# EAGLE design OpenponicsBoard_Photon_V1.0 (EAGLE 7.2.0)
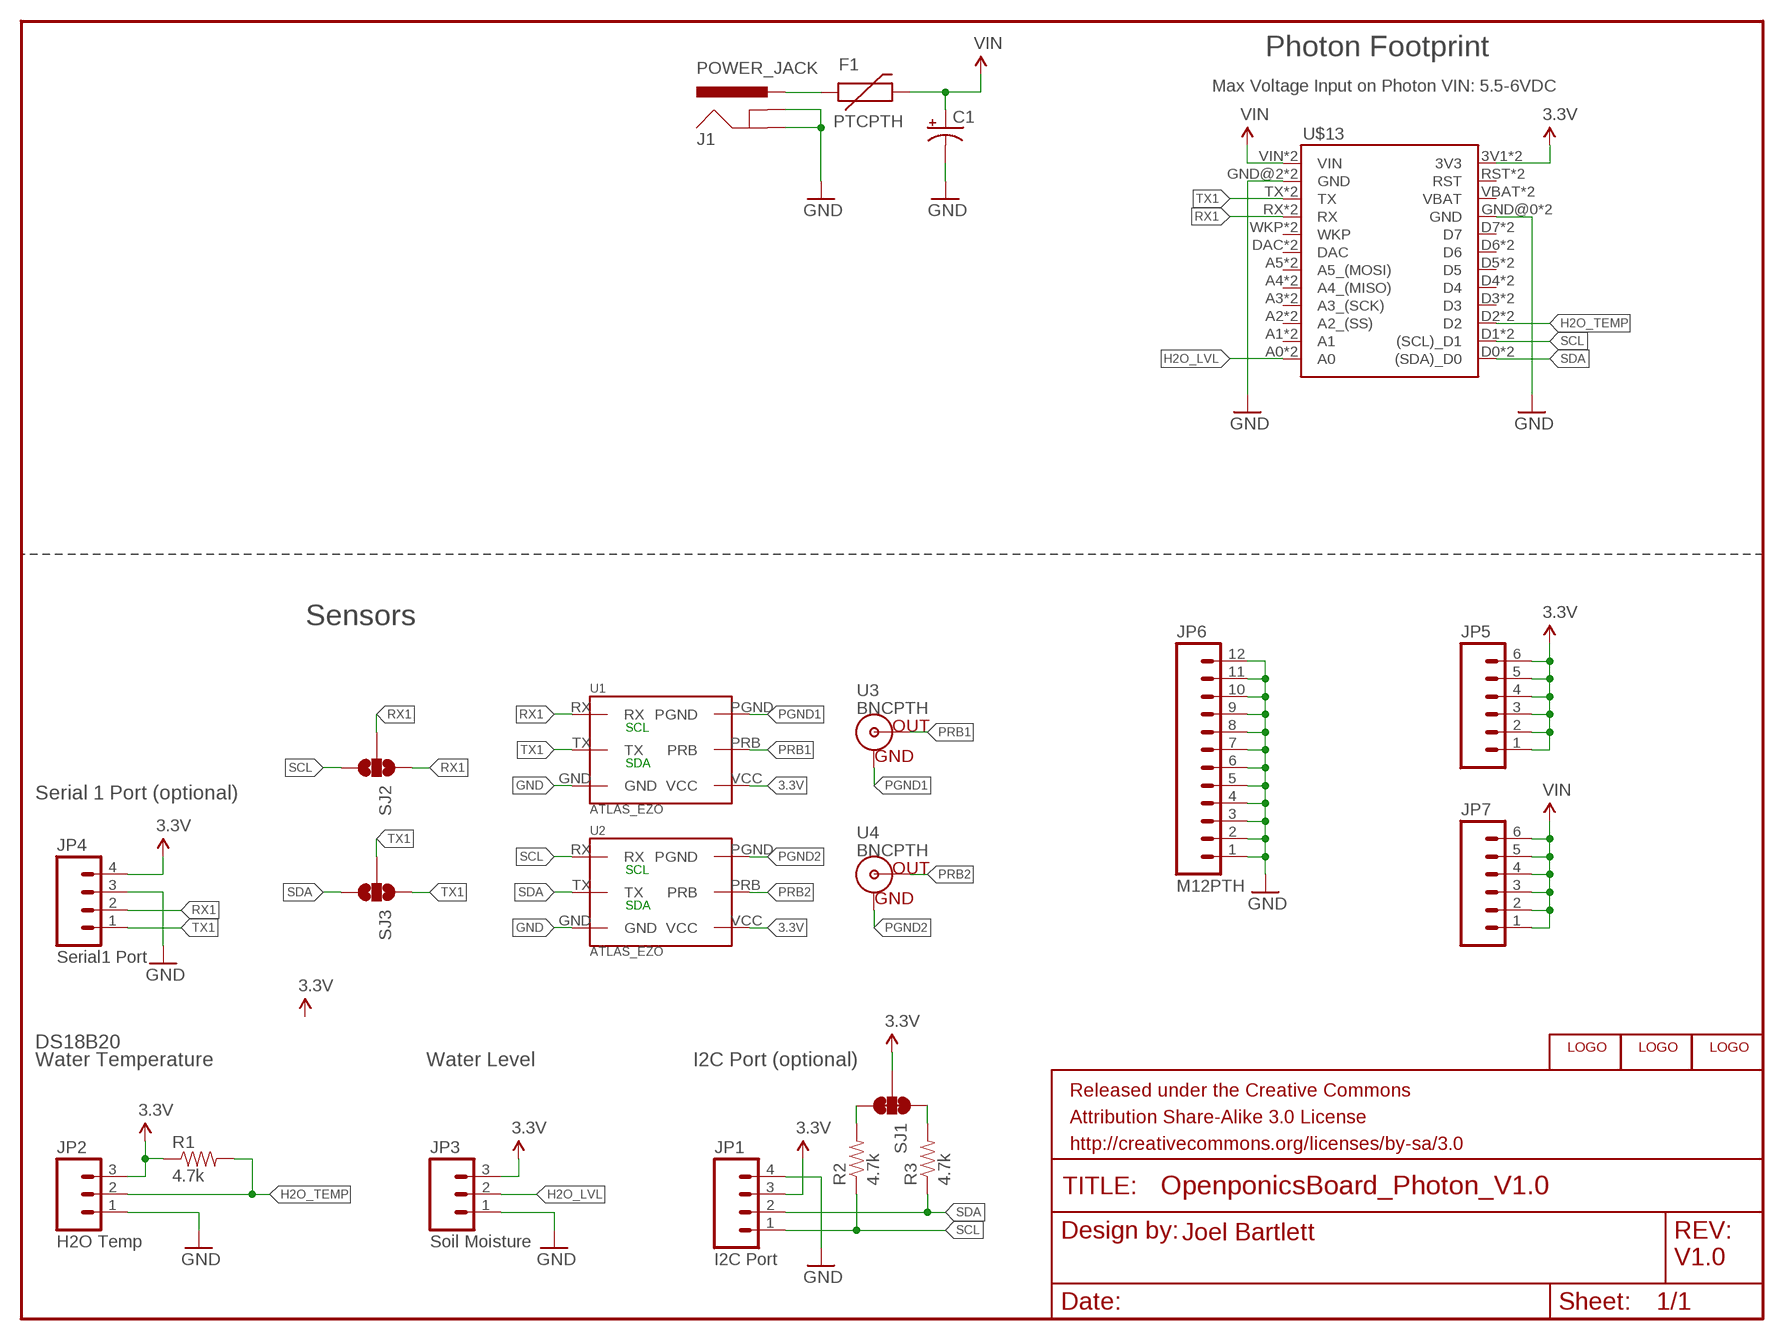
[diagram p0: schematic, sheet 1]

## Parts
C1  CAP_POLPTH1  [CPOL-RADIAL-100UF-25V]
F1  PTCPTH  [PTC]
FRAME1  FRAME-LETTER  [CREATIVE_COMMONS]
J1  POWER_JACK  POWER_JACKPTH  [POWER_JACK_PTH]
JP1  I2C Port  M04PTH  [1X04]
JP2  H2O Temp  M03PTH  [1X03]
JP3  Soil Moisture  M03PTH  [1X03]
JP4  Serial1 Port  M04PTH  [1X04]
JP5  M06SIP  [1X06]
JP6  M12PTH  [1X12]
JP7  M06SIP  [1X06]
R1  4.7k  RESISTORPTH-1/4W  [AXIAL-0.4]
R2  4.7k  RESISTORPTH-1/4W  [AXIAL-0.4]
R3  4.7k  RESISTORPTH-1/4W  [AXIAL-0.4]
SJ1  JUMPER-PAD-3-NC_BY_TRACE  [PAD-JUMPER-3-3OF3_NC_BY_TRACE_YES_SILK_FULL_BOX]
SJ2  SOLDERJUMPER_2WAYS  [SJ_3]
SJ3  SOLDERJUMPER_2WAYS  [SJ_3]
U1  ATLAS_EZO  [ATLAS_EZO]
U2  ATLAS_EZO  [ATLAS_EZO]
U3  BNCPTH  [BNC]
U4  BNCPTH  [BNC]
U$5  OPENPONICS_LOGO_SYMBOL  [OPENPONICS_LOGO_SYMBOL]
U$6  OPENPONICS_LOGO_SMALL  [OPENPONICS_LOGO_SMALL]
U$9  OPENPONICS_LOGO_SYMBOL_MED  [OPENPONICS_LOGO_SYMBOL_MED]
U$13  PHOTON_FOOTPRINT_X2  [PHOTON_FOOTPRINT_X2]

## Nets
3.3V: JP1.3 JP2.3 JP3.3 JP4.4 JP5.1 JP5.2 JP5.3 JP5.4 JP5.5 JP5.6 R1.P$1 SJ1.2 U1.VCC U2.VCC U$13.3V1(3V3) U$13.3V3
GND: C1.2(-) J1.GND J1.GNDBREAK JP1.4 JP2.1 JP3.1 JP4.3 JP6.1 JP6.2 JP6.3 JP6.4 JP6.5 JP6.6 JP6.7 JP6.8 JP6.9 JP6.10 JP6.11 JP6.12 U1.GND U2.GND U$13.GND@0(GND) U$13.GND@1(GND) U$13.GND@2(GND) U$13.GND@2_1(GND)
H2O_LVL: JP3.2 U$13.A0 U$13.A0_1(A0)
H2O_TEMP: JP2.2 R1.P$2 U$13.D2 U$13.D2_1(D2)
N$3: R2.P$2 SJ1.3
N$6: R3.P$2 SJ1.1
PGND1: U1.PGND U3.GND
PGND2: U2.PGND U4.GND
PRB1: U1.PRB U3.S(OUT)
PRB2: U2.PRB U4.S(OUT)
RAW: F1.P$1 J1.PWR
RX1: JP4.2 SJ2.1 SJ2.2 U1.RX U$13.RX U$13.RX1(RX)
SCL: JP1.1 R2.P$1 SJ2.3 U2.RX U$13.D1((SCL)_D1) U$13.D1_1((SCL)_D1)
SDA: JP1.2 R3.P$1 SJ3.3 U2.TX U$13.D0((SDA)_D0) U$13.D0_1((SDA)_D0)
TX1: JP4.1 SJ3.1 SJ3.2 U1.TX U$13.TX U$13.TX1(TX)
VIN: C1.1(+) F1.P$2 JP7.1 JP7.2 JP7.3 JP7.4 JP7.5 JP7.6 U$13.VIN U$13.VIN1(VIN)
Unconnected: U$13.A1 U$13.A1_1(A1) U$13.A2(A2_(SS)) U$13.A2_1(A2_(SS)) U$13.A3(A3_(SCK)) U$13.A3_1(A3_(SCK)) U$13.A4(A4_(MISO)) U$13.A4_1(A4_(MISO)) U$13.A5(A5_(MOSI)) U$13.A5_1(A5_(MOSI)) U$13.D3 U$13.D3_1(D3) U$13.D4 U$13.D4_1(D4) U$13.D5 U$13.D5_1(D5) U$13.D6 U$13.D6_1(D6) U$13.D7 U$13.D7_1(D7) U$13.DAC U$13.DAC1(DAC) U$13.RST U$13.RST1(RST) U$13.VBAT U$13.VBAT1(VBAT) U$13.WKP U$13.WKP1(WKP)

## Notes on the sheet
- Photon Footprint
- Max Voltage Input on Photon VIN: 5.5-6VDC
- Sensors
- SCL
- SDA
- Serial 1 Port (optional)
- SCL
- SDA
- DS18B20
- Water Temperature | Water Level | I2C Port (optional)
- Joel Bartlett
- V1.0

## Library data of the parts
C1 = SparkFun-Capacitors:CAP_POL: Capacitor Polarized These are standard SMD and PTH capacitors. Normally 10uF, 47uF, and 100uF in electrolytic and tantalum varieties. Always verify the external diameter of the through hole cap, it varies with capacity, voltage, and manufacturer. The EIA devices should be standard.
F1 = SparkFun-PowerIC:PTC: Resettable Fuse PTC Resettable Fuse. Spark Fun Electronics SKU : COM-08357
FRAME1 = SparkFun-Aesthetics:FRAME-LETTER: Schematic Frame Standard 8.5x11 US Letter frame
J1 = SparkFun-Connectors:POWER_JACK: Power Jack This is the standard 5.5mm barrel jack for power. The PTH is the most common, proven, reliable, footprint. The Slot footprint only works if the mill layer is transmitted to the PCB fab house so be warned. Spark Fun Electronics SKU : PRT-00119 SMT: CONN-08106 Mating wall wart : TOL-00298 (and others)
JP1 JP4 = SparkFun-Connectors:M04: Header 4 Standard 4-pin 0.1" header. Use with straight break away headers (SKU : PRT-00116), right angle break away headers (PRT-00553), swiss pins (PRT-00743), machine pins (PRT-00117), and female headers (PRT-00115). Molex polarized connector foot print use with SKU : PRT-08231 with associated crimp pins and housings. 1MM SMD Version SKU: PRT-10208
JP2 JP3 = SparkFun-Connectors:M03: Header 3 Standard 3-pin 0.1" header. Use with straight break away headers (SKU : PRT-00116), right angle break away headers (PRT-00553), swiss pins (PRT-00743), machine pins (PRT-00117), and female headers (PRT-00115). Molex polarized connector foot print use with SKU : PRT-08232 with associated crimp pins and housings.
JP5 JP7 = SparkFun-Connectors:M06: Header 6 Standard 6-pin 0.1" header. Use with straight break away headers (SKU : PRT-00116), right angle break away headers (PRT-00553), swiss pins (PRT-00743), machine pins (PRT-00117), and female headers (PRT-00115). Molex polarized connector foot print use with SKU : PRT-08094 with associated crimp pins and housings. NOTES ON THE VARIANTS LOCK and LOCK_LONGPADS... This footprint was designed to help hold the alignment of a through-hole component (i.e. 6-pin header) while soldering it into place. You may notice that each hole has been shifted either up or down by 0.005 of an inch from it's more standard position (which is a perfectly straight line). This slight alteration caused the pins (the squares in the middle) to touch the edges of the holes. Because they are alternating, it causes a "brace" to hold the component in place. 0.005 has proven to be the perfect amount of "off-center" position when using our standard breakaway headers. Although looks a little odd when you look at the bare footprint, once you have a header in there, the alteration is very hard to notice. Also,if you push a header all the way into place, it is covered up entirely on the bottom side. This idea of altering the position of holes to aid alignment will be further integrated into the Sparkfun Library for other footprints. It can help hold any component with 3 or more connection pins.
JP6 = SparkFun-Connectors:M12: Header 12 Standard 12-pin 0.1" header. Use with straight break away headers (SKU : PRT-00116), right angle break away headers (PRT-00553), swiss pins (PRT-00743), machine pins (PRT-00117), and female headers (PRT-00115).
R1-R3 = SparkFun-Resistors:RESISTOR: Resistor Basic schematic elements and footprints for 0603, 1206, and PTH resistors.
SJ1 = SparkFun-Passives:JUMPER-PAD-3-NC_BY_TRACE
SJ2 SJ3 = SparkFun-Passives:SOLDERJUMPER_2WAY: Solder Jumper 2 way solder jumper
U1 U2 = AtlasScientific:ATLAS_EZO: Atlas Scientific EZO Circuit
U3 U4 = SparkFun-Connectors:BNC: BNC Connector, Mouser Part# 5227161
U$5 = Openponics:OPENPONICS_LOGO_SYMBOL
U$6 = Openponics:OPENPONICS_LOGO_SMALL
U$9 = Openponics:OPENPONICS_LOGO_SYMBOL_MED
U$13 = Openponics:PHOTON_FOOTPRINT_X2

## Net classes
0 Default: width 0.203 mm
1 vcc: width 0.203 mm

## Board
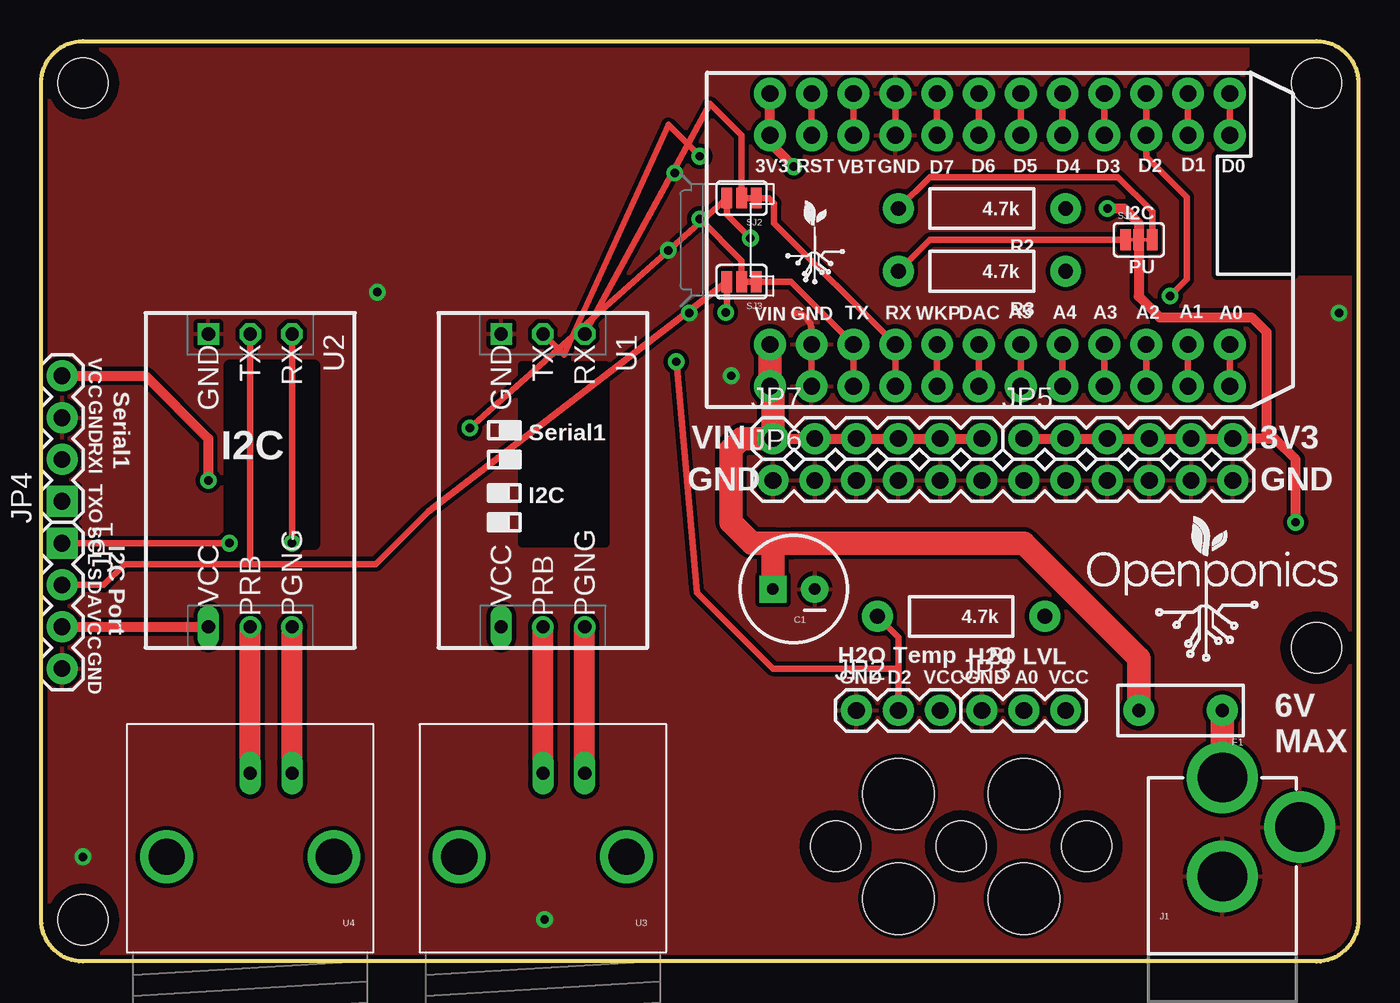
[diagram p1: board, top side]
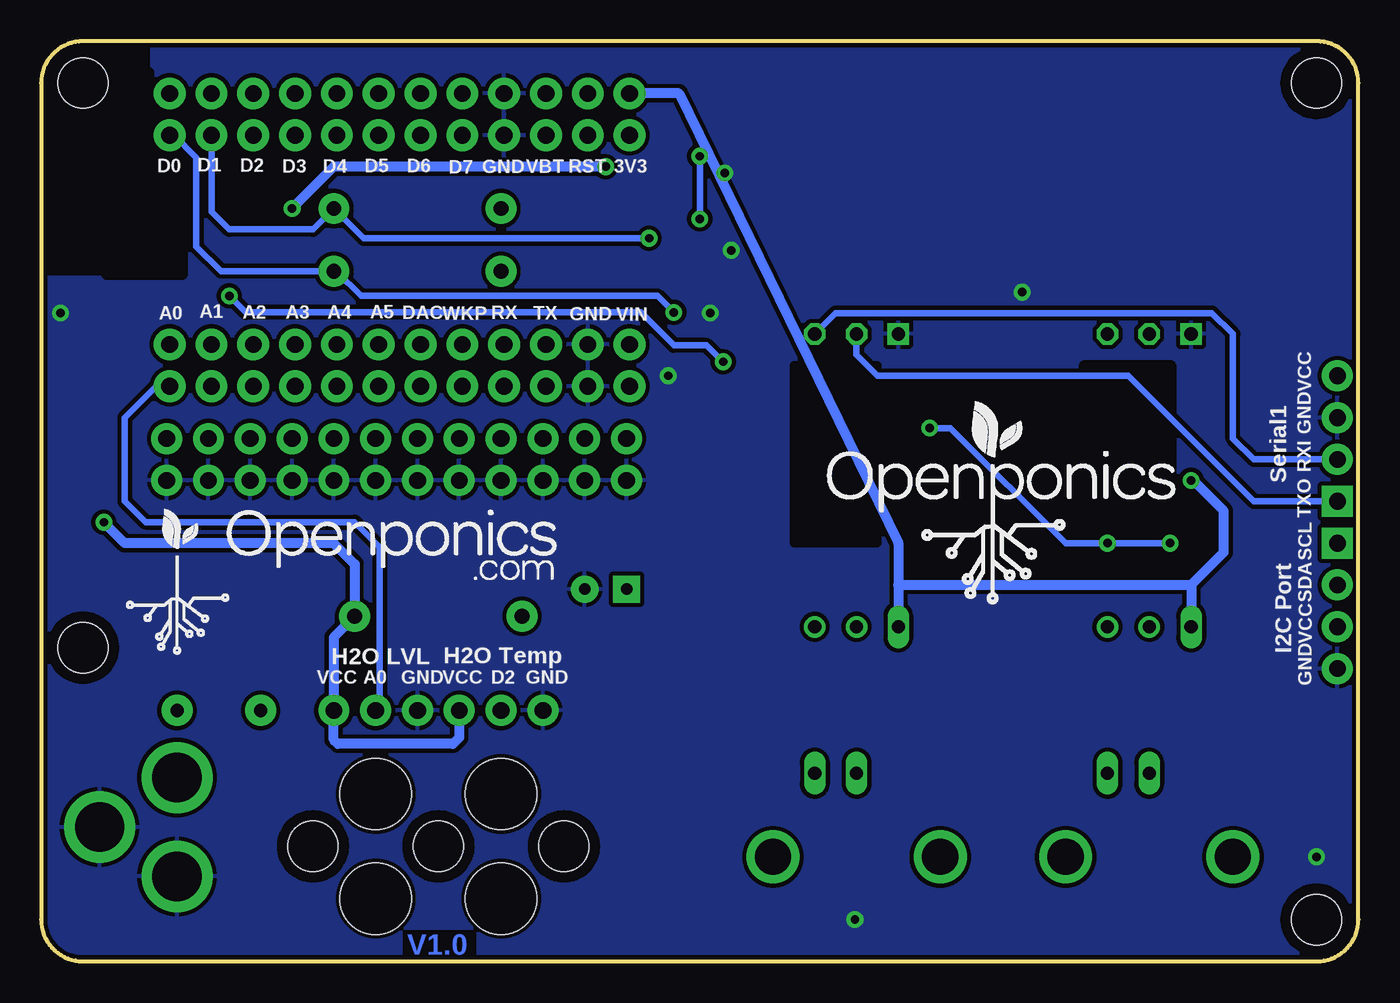
[diagram p2: board, bottom side, seen from below]

Size 80.01 x 55.88 mm. Coordinates in mm from the lower left corner, seen from the top.
Outline: 2.54,0 arc-90 0,2.54 0,53.34 arc-90 2.54,55.88 77.47,55.88 arc-90 80.01,53.34 80.01,2.54 arc-90 77.47,0 2.54,0
Copper layers (1*16): Top 0.035mm / dielectric 1.5mm / Bottom 0.035mm
Design rules "SparkFun-2-layer-STANDARD": minimum track width 10mil, minimum drill 20mil, track to track 10mil, track to pad 8mil, pad to pad 8mil, via to via 10mil, smd to smd 8mil, copper to edge 8mil, drill to drill 8mil, minimum pad ring 10mil, minimum via ring 10mil, stop-mask expansion 4mil, vias tented up to drill 20mil, thermal gap 10mil
Holes 4.32 mm at 52.07,3.81 52.07,10.16 59.69,10.16 59.69,3.81
tRestrict: area 29.2,25.4 to 34.3,36.2; area 73.7,41.9 to 80,55.9; 4 lines
bRestrict: area 29.2,25.4 to 34.3,36.2; area 73.7,41.9 to 80,55.9; 4 lines

### Footprints (pad centres in the part's own frame; a part is rotated, then mirrored left to right if it is on the bottom)
CPOL-RADIAL-100UF-25V = drill 0.7 pad 1.651 square: 1 1.27,0 | drill 0.7 pad 1.651: 2 -1.27,0
PTC = drill 0.8 pad 1.88: P$1 -2.54,0; P$2 2.54,0
POWER_JACK_PTH = drill 2.997 pad 4.318: GND 0,7.7; GNDBREAK 4.7,10.7; PWR 0,13.7
1X04 = drill 1.016 pad 1.88 square: 1 0,0 | drill 1.016 pad 1.88: 2 2.54,0; 3 5.08,0; 4 7.62,0
1X03 = drill 1.016 pad 1.88: 1 0,0; 2 2.54,0; 3 5.08,0
1X06 = drill 1.016 pad 1.88: 1 0,0; 2 2.54,0; 3 5.08,0; 4 7.62,0; 5 10.16,0; 6 12.7,0
1X12 = drill 1.016 pad 1.88: 1 0,0; 2 2.54,0; 3 5.08,0; 4 7.62,0; 5 10.16,0; 6 12.7,0; 7 15.24,0; 8 17.78,0; 9 20.32,0; 10 22.86,0; 11 25.4,0; 12 27.94,0
AXIAL-0.4 = drill 0.9 pad 1.88: P$1 -5.08,0; P$2 5.08,0
PAD-JUMPER-3-3OF3_NC_BY_TRACE_YES_SILK_FULL_BOX = smd 0.635 x 1.27: 1 -0.813,0; 2 0,0; 3 0.813,0
SJ_3 = smd 0.635 x 1.27: 1 -0.889,0; 2 0,0; 3 0.889,0
ATLAS_EZO = drill 0.8 square: GND -8.89,-2.54 | drill 0.8: PGND 8.89,2.54; PRB 8.89,0 | drill 0.8 octagon: RX -8.89,2.54; TX -8.89,0 | drill 0.8 long: VCC 8.89,-2.54
BNC = drill 2.2: 3 -5.08,5.08; 4 5.08,5.08 | drill 0.8 long: GND -2.54,0; S 0,0
STAND-OFF-TIGHT = hole 3.048: 0,0
PHOTON_FOOTPRINT_X2 = drill 1.016 pad 1.93: 3V1 5.715,12.885; 3V3 8.255,12.885; A0 -9.525,-15.055; A0_1 -6.985,-15.055; A1 -9.525,-12.515; A1_1 -6.985,-12.515; A2 -9.525,-9.975; A2_1 -6.985,-9.975; A3 -9.525,-7.435; A3_1 -6.985,-7.435; A4 -9.525,-4.895; A4_1 -6.985,-4.895; A5 -9.525,-2.355; A5_1 -6.985,-2.355; D0 8.255,-15.055; D0_1 5.715,-15.055; D1 8.255,-12.515; D1_1 5.715,-12.515; D2 8.255,-9.975; D2_1 5.715,-9.975; D3 8.255,-7.435; D3_1 5.715,-7.435; D4 8.255,-4.895; D4_1 5.715,-4.895; D5 8.255,-2.355; D5_1 5.715,-2.355; D6 8.255,0.185; D6_1 5.715,0.185; D7 8.255,2.725; D7_1 5.715,2.725; DAC -9.525,0.185; DAC1 -6.985,0.185; GND@0 -9.525,10.345; GND@1 -6.985,10.345; GND@2 8.255,5.265; GND@2_1 5.715,5.265; RST 8.255,10.345; RST1 5.715,10.345; RX -9.525,5.265; RX1 -6.985,5.265; TX -9.525,7.805; TX1 -6.985,7.805; VBAT 8.255,7.805; VBAT1 5.715,7.805; VIN -9.525,12.885; VIN1 -6.985,12.885; WKP -9.525,2.725; WKP1 -6.985,2.725

### Placement (x,y rotation side)
C1  45.72,22.61 180 top
F1  69.22,15.24 180 top
FRAME1  27.94,-16.51 0 top  (outside the outline)
J1  71.75,-2.54 0 top
JP1  1.27,25.4 270 top
JP2  49.53,15.24 0 top
JP3  57.15,15.24 0 top
JP4  1.27,27.94 90 top
JP5  59.69,31.75 0 top
JP6  44.45,29.21 0 top
JP7  44.45,31.75 0 top
R1  55.88,20.96 180 top
R2  57.15,45.72 180 top
R3  57.15,41.91 180 top
SJ1  66.67,43.81 0 top
SJ2  42.55,46.36 180 top
SJ3  42.55,41.28 180 top
U1  30.48,29.21 270 top
U2  12.7,29.21 270 top
U3  30.48,11.43 180 top
U4  12.7,11.43 180 top
U$1  [STAND-OFF-TIGHT]  2.54,53.34 0 top
U$2  [STAND-OFF-TIGHT]  2.54,2.54 0 top
U$3  [STAND-OFF-TIGHT]  77.47,19.05 0 top
U$4  [STAND-OFF-TIGHT]  77.47,53.34 0 top
U$5  46.99,41.28 0 top
U$6  70.76,18.44 0 top
U$7  [OPENPONICS_LOGO_MED]  22.2,22.05 0 bottom
U$8  [STAND-OFF-TIGHT]  55.88,6.99 0 top
U$9  71.75,18.87 0 bottom
U$10  [STAND-OFF-TIGHT]  63.5,6.99 0 top
U$11  [STAND-OFF-TIGHT]  48.26,6.99 0 top
U$12  [OPENPONICS_LOGO_.COM]  48.9,23.16 0 bottom
U$13  57.15,44.45 90 top

### Tracks (layer width: path | path; a pad name or v marks a point on that pad's centre or on a via)
3.3V  (via drill 0.51)
  Top 0.61: JP1.3 U2.VCC | JP4.4 6.35,35.56 10.16,31.75 v10.16,29.21 | v64.77,45.72 65.79,45.72 66.67,44.83 SJ1.2 66.67,40.39 67.94,39.12 73.53,39.12 74.42,38.23 74.42,31.75 | U$13.3V3 U$13.3V1 44.27,49.72 v45.72,48.26 | JP5.1 JP5.2 JP5.3 JP5.4 JP5.5 JP5.6 74.42,31.75 | v76.2,26.67 76.2,30.48 74.93,31.75 74.42,31.75
  Bottom 0.406: U1.VCC 27.94,21.59
  Bottom 0.61: 10.16,22.86 U2.VCC | 27.94,22.86 10.16,22.86 | 27.94,22.86 27.94,25.4 41.27,52.7 U$13.3V3 | 27.94,22.86 U1.VCC | v45.72,48.26 62.23,48.26 v64.77,45.72 | v76.2,26.67 74.93,25.4 62.23,25.4 60.96,24.13 R1.P$1 62.23,19.69 JP3.3 62.23,13.46 61.98,13.21 54.99,13.21 54.61,13.59 JP2.3 | 10.16,22.86 8.18,24.84 8.18,27.36 10.03,29.21 v10.16,29.21
GND  (via drill 0.51)
  Top 0.406: U$13.GND@1 46.8,38.28 arc90 45.72,39.37
  other vias: 41.91,35.56 39.37,39.37 38.1,43.18 38.48,47.88 2.54,6.35 30.58,2.54 20.42,40.64 78.84,39.37
  pour Top (isolate 0.254): 0,55.88 80.01,55.88 80.01,0 0,0
  pour Bottom (isolate 0.254): 0,55.88 80.01,55.88 80.01,0 0,0
H2O_LVL
  Top 0.406: U$13.A0_1 U$13.A0
  Bottom 0.406: U$13.A0 73.03,34.92 74.93,33.02 74.93,27.94 73.66,26.67 60.96,26.67 59.44,25.15 59.44,15.49 JP3.2
H2O_TEMP  (via drill 0.51)
  Top 0.406: JP2.2 52.07,17.78 | 52.07,17.78 52.07,19.69 R1.P$2 | v38.58,36.41 39.85,22.38 44.45,17.78 52.07,17.78 | v68.58,40.41 69.58,41.41 69.58,46.41 67.12,48.86 U$13.D2_1 U$13.D2
  Bottom 0.406: v38.58,36.41 39.58,37.41 41.58,37.41 43.58,39.41 67.58,39.41 v68.58,40.41
N$3
  Top 0.406: R2.P$2 53.98,47.62 65.41,47.62 67.49,45.54 SJ1.3
N$6
  Top 0.406: SJ1.1 53.98,43.81 R3.P$2
PGND1
  Top 1.27: U3.GND U1.PGND
PGND2
  Top 1.27: U4.GND U2.PGND
PRB1
  Top 1.27: U3.S U1.PRB
PRB2
  Top 1.27: U4.S U2.PRB
RAW
  Top 1.422: J1.PWR F1.P$1
RX1
  Top 0.406: U$13.RX U$13.RX1 44.52,44.83 44.52,46.03 44.2,46.36 SJ2.1 SJ2.2 42.55,50.17 40.64,52.07 U1.RX
  Bottom 0.406: JP4.2 6.35,30.48 7.62,31.75 7.62,38.1 8.89,39.37 31.75,39.37 U1.RX
SCL  (via drill 0.51)
  Top 0.406: v26.04,32.39 SJ2.3 41.66,45.33 v43.08,43.91 | U2.RX v15.24,25.4 | JP1.1 v11.43,25.4 | U$13.D1_1 U$13.D1
  Bottom 0.406: v11.43,25.4 v15.24,25.4 17.78,25.4 24.77,32.39 v26.04,32.39 | U$13.D1_1 69.67,45.53 68.58,44.45 63.5,44.45 R2.P$1 60.42,43.91 v43.08,43.91
SDA  (via drill 0.51)
  Top 0.406: 12.7,24.13 20.32,24.13 23.5,27.3 SJ3.3 41.66,39.49 v41.58,39.41 | 12.7,24.13 5.08,24.13 3.81,22.86 JP1.2 | U2.TX 12.7,24.13 | U$13.D0_1 U$13.D0
  Bottom 0.406: U$13.D0_1 71.94,50.17 70.58,48.81 70.58,43.41 69.08,41.91 R3.P$1 62.08,41.91 60.58,40.41 42.58,40.41 v41.58,39.41
TX1  (via drill 0.51)
  Top 0.406: v40.01,45.09 42.55,42.55 SJ3.2 SJ3.1 45.53,41.28 U$13.TX1 U$13.TX | v40.01,48.89 38.1,50.8 31.75,36.83 U1.TX
  Bottom 0.406: v40.01,45.09 v40.01,48.89 | U1.TX 30.48,36.83 29.21,35.56 13.97,35.56 6.35,27.94 JP4.1
VIN
  Top 0.406: 44.45,34.74 U$13.VIN
  Top 0.61: JP7.1 JP7.2 JP7.3 JP7.4 JP7.5 JP7.6
  Top 1.422: 44.45,34.74 JP7.1 42.55,31.75 41.91,31.12 41.91,26.67 43.18,25.4 44.45,25.4 | F1.P$2 66.67,18.42 59.69,25.4 45.72,25.4 44.45,25.4 | U$13.VIN U$13.VIN1 | C1.1 44.45,25.4

### Text on the board
Bottom: V1.0
tPlace: I2C | PU | VCC | GND | Serial1 | Serial1 | RXI | VIN | 3V3 | I2C | TXO | I2C | GND | GND | SCL | I2C Port | SDA | VCC | GND | H2O Temp | H2O LVL | GND | D2 | VCC | GND | A0 | VCC | 6V / MAX
bPlace: VCC | GND | RXI | Serial1 | TXO | SCL | SDA | VCC | I2C Port | H2O Temp | H2O LVL | GND | GND | D2 | VCC | GND | A0 | VCC